# EAGLE design ECU (EAGLE 6.6.0)

## Sheet 1 of 3
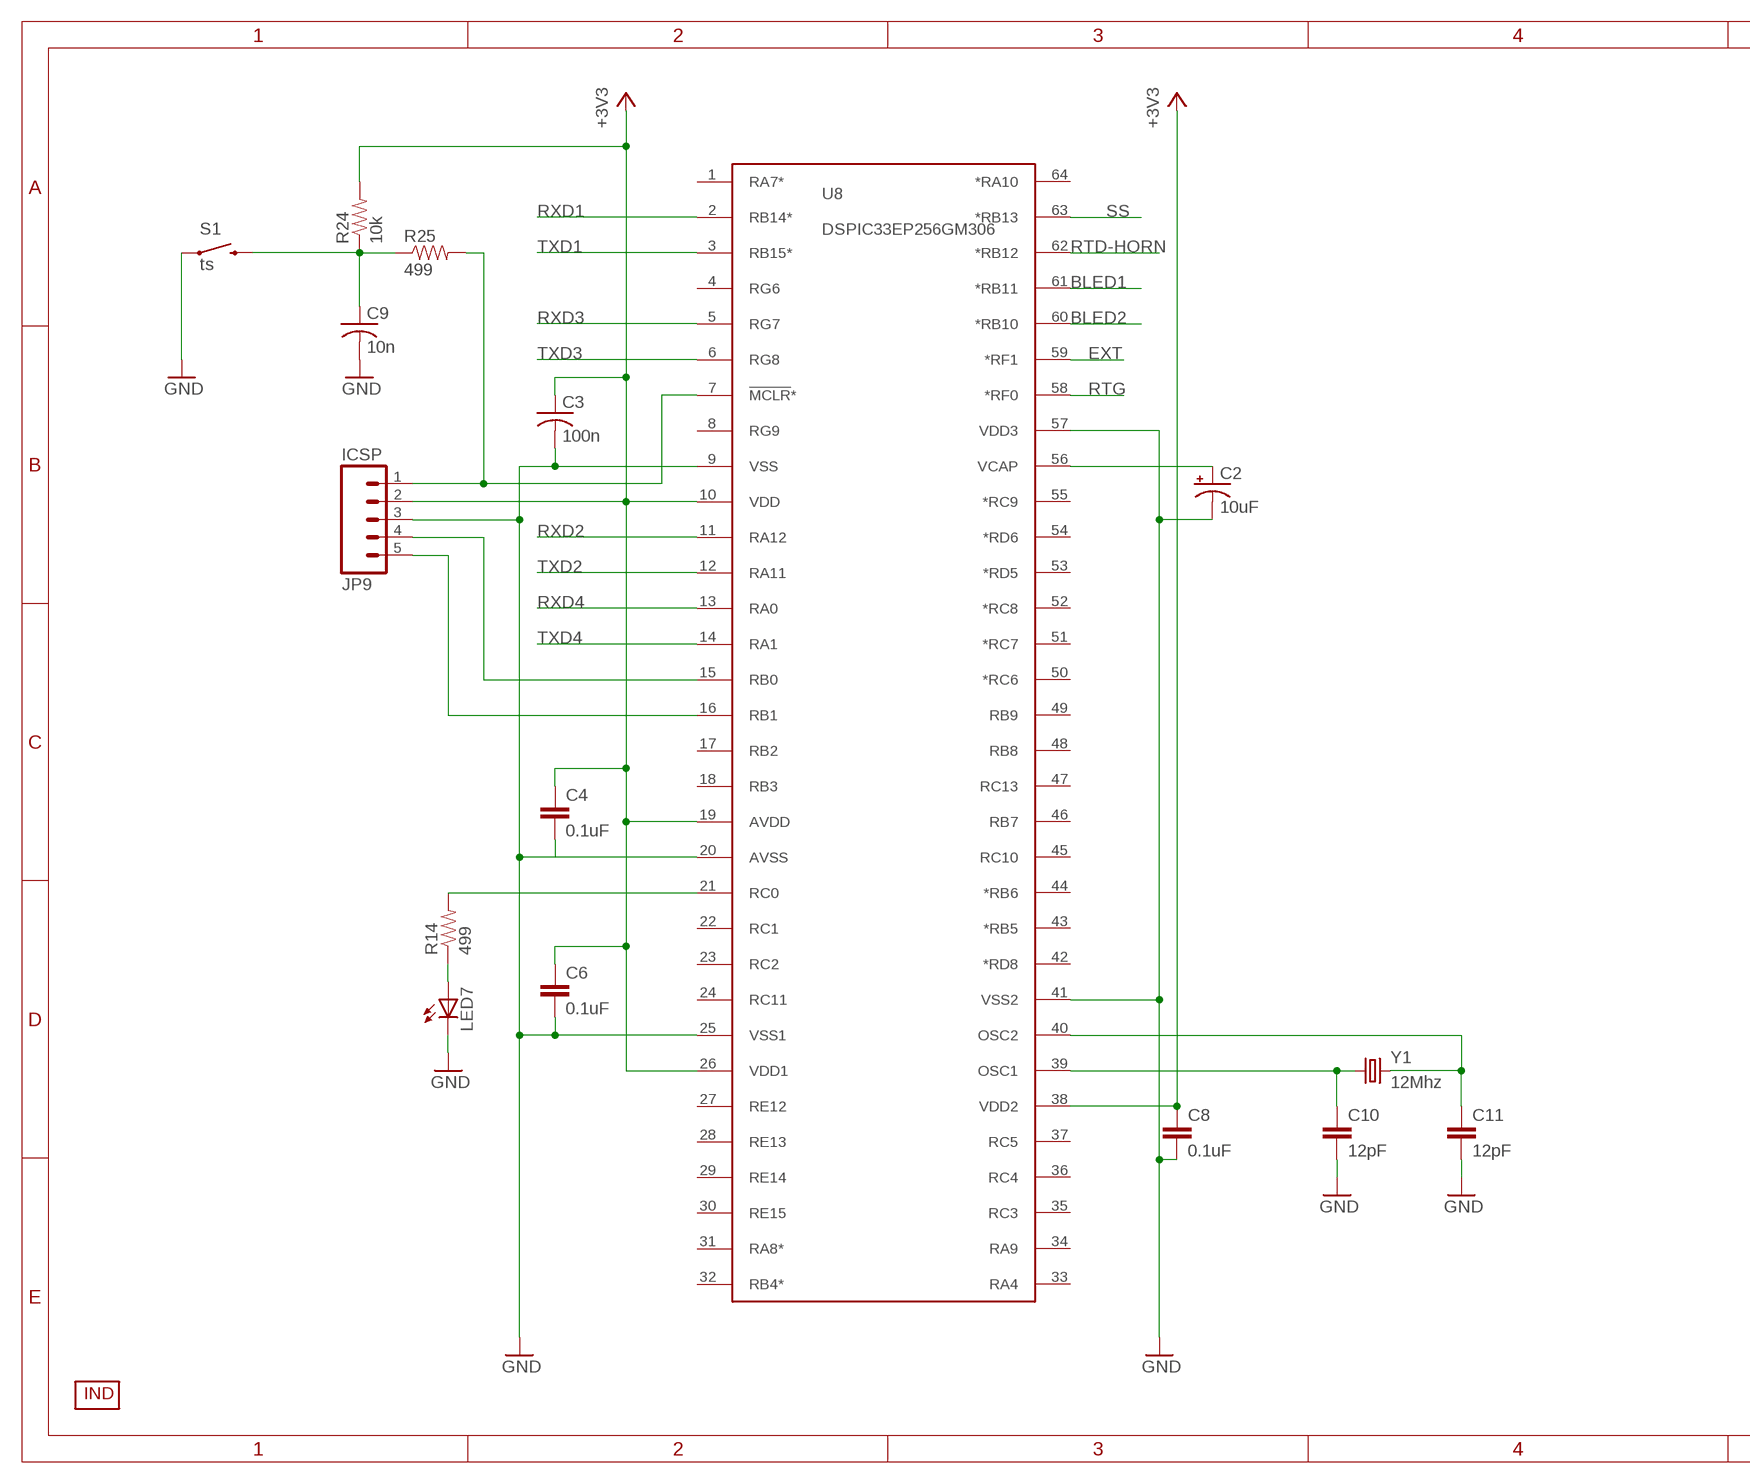
[diagram p0: schematic, sheet 1, part 1 of 2]
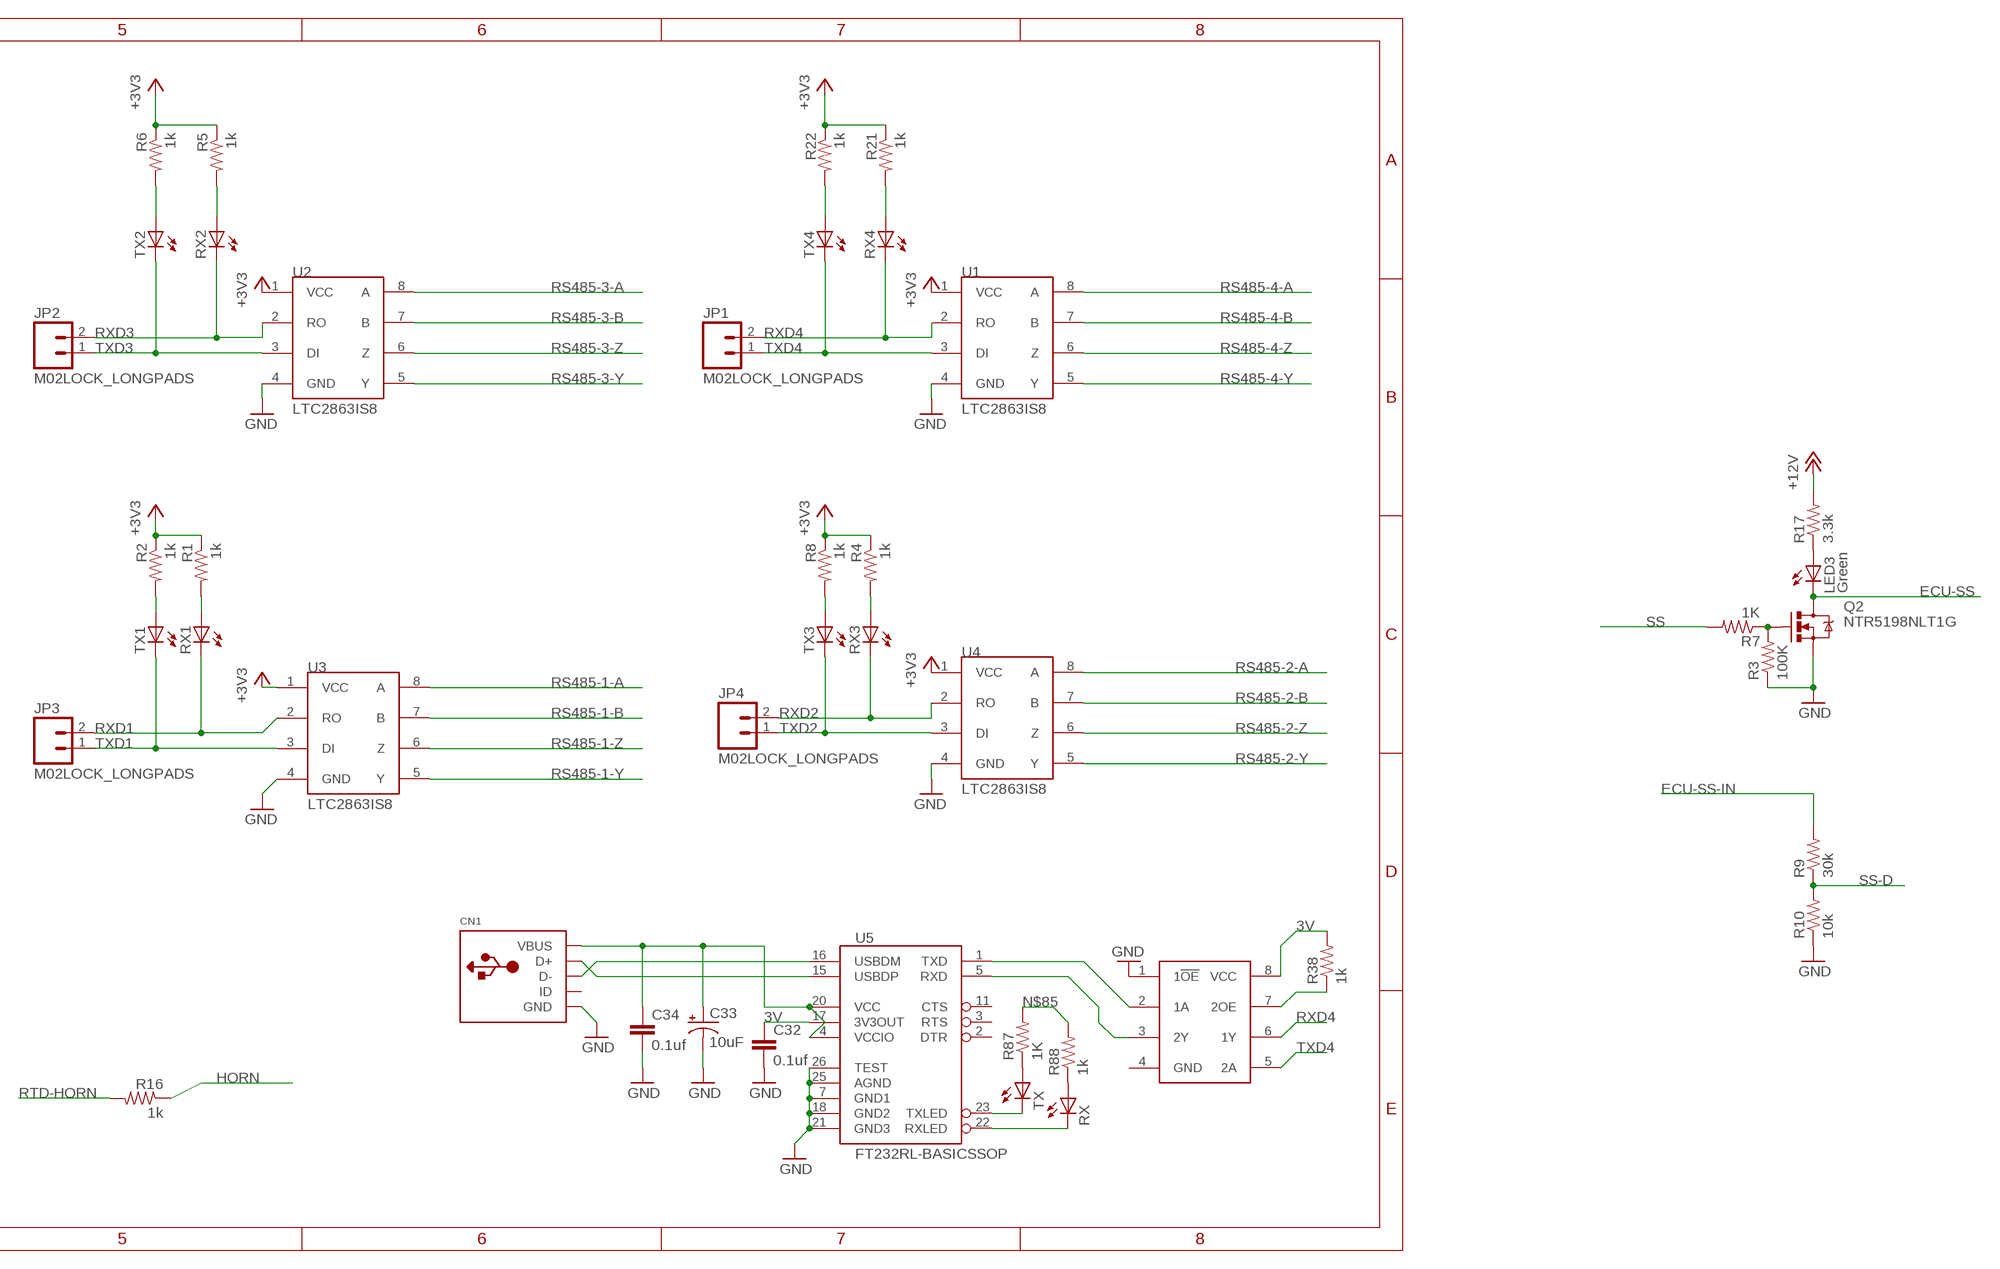
[diagram p1: schematic, sheet 1, part 2 of 2]

### Parts
C2  10uF  10UF-TANT  [EIA3216]
C3  100n  C-USC0805  [C0805]
C4  0.1uF  CAP0805  [0805]
C6  0.1uF  CAP0805  [0805]
C8  0.1uF  CAP0805  [0805]
C9  10n  C-USC0805  [C0805]
C10  12pF  CAP0805  [0805]
C11  12pF  CAP0805  [0805]
C32  0.1uf  CAP0805  [0805]
C33  10uF  CAP_POL1206  [EIA3216]
C34  0.1uf  CAP0805  [0805]
CN1  USBMOLEX  [USB-MINIB-THM-MOLEX]
JP1  M02LOCK_LONGPADS  [1X02_LOCK_LONGPADS]
JP2  M02LOCK_LONGPADS  [1X02_LOCK_LONGPADS]
JP3  M02LOCK_LONGPADS  [1X02_LOCK_LONGPADS]
JP4  M02LOCK_LONGPADS  [1X02_LOCK_LONGPADS]
JP9  ICSP  M05LOCK_LONGPADS  [1X05_LOCK_LONGPADS]
LED3  Green  LEDCHIPLED_0805  [CHIPLED_0805]
LED7  LEDCHIP-LED0805  [CHIP-LED0805]
Q2  NTR5198NLT1G  MOSFET-NCHANNELBSS123LT1G  [SOT23]
R1  1k  RESISTOR0805-RES  [0805]
R2  1k  RESISTOR0805-RES  [0805]
R3  100K  R-US_R0805  [R0805]
R4  1k  RESISTOR0805-RES  [0805]
R5  1k  RESISTOR0805-RES  [0805]
R6  1k  RESISTOR0805-RES  [0805]
R7  1K  R-US_R0805  [R0805]
R8  1k  RESISTOR0805-RES  [0805]
R9  30k  R-US_R0805  [R0805]
R10  10k  R-US_R0805  [R0805]
R14  499  RESISTOR0805-RES  [0805]
R16  1k  RESISTOR0805-RES  [0805]
R17  3.3k  R-US_R0805  [R0805]
R21  1k  RESISTOR0805-RES  [0805]
R22  1k  RESISTOR0805-RES  [0805]
R24  10k  RESISTOR0805-RES  [0805]
R25  499  RESISTOR0805-RES  [0805]
R38  1k  R-US_R0805  [R0805]
R87  1K  R-US_R0805  [R0805]
R88  1k  R-US_R0805  [R0805]
RX  LEDCHIPLED_0805  [CHIPLED_0805]
RX1  LEDCHIP-LED0805  [CHIP-LED0805]
RX2  LEDCHIP-LED0805  [CHIP-LED0805]
RX3  LEDCHIP-LED0805  [CHIP-LED0805]
RX4  LEDCHIP-LED0805  [CHIP-LED0805]
S1  ts  SWITCH-MOMENTARY-2SIDE_EZ  [TACTILE-PTH-SIDEEZ]
TX  LEDCHIPLED_0805  [CHIPLED_0805]
TX1  LEDCHIP-LED0805  [CHIP-LED0805]
TX2  LEDCHIP-LED0805  [CHIP-LED0805]
TX3  LEDCHIP-LED0805  [CHIP-LED0805]
TX4  LEDCHIP-LED0805  [CHIP-LED0805]
U1  LTC2863IS8  ISL83077  [SO08]
U2  LTC2863IS8  ISL83077  [SO08]
U3  LTC2863IS8  ISL83077  [SO08]
U4  LTC2863IS8  ISL83077  [SO08]
U5  FT232RL-BASICSSOP  [SSOP28DB]
U8  DSPIC33EP256GM306  [TQFP-64]
U14  SN74LVC2G241DCTR  [VFSOP-8]
U$1  INDPK1  [PICKIT-PIN-1]
Y1  12Mhz  CRYSTAL5X3  [CRYSTAL-SMD-5X3]

### Nets
3V: C32.1 R38.2 U5.17(3V3OUT) U14.8(VCC)
!RESET: JP9.1 R25.2 U8.7(!MCLR!*)
+3V3: C3.1 C4.1 C6.1 C8.1 JP9.2 R1.1 R2.1 R4.1 R5.1 R6.1 R8.1 R21.1 R22.1 R24.2 U1.1(VCC) U2.1(VCC) U3.1(VCC) U4.1(VCC) U8.10(VDD) U8.19(AVDD) U8.26(VDD1) U8.38(VDD2) ; also sheet 2
+12V: R17.2 ; also sheet 3
BLED1: U8.61(*RB11)
BLED2: U8.60(*RB10)
ECU-SS: LED3.C Q2.3(D) ; also sheet 3
ECU-SS-IN: R9.2 ; also sheet 3
EXT: U8.59(*RF1)
GND: C2.C(-) C3.2 C4.2 C6.2 C8.2 C9.2 C10.2 C11.2 C32.2 C33.C(-) C34.2 CN1.GND JP9.3 LED7.C Q2.2(S) R3.1 R10.1 S1.1 U1.4(GND) U2.4(GND) U3.4(GND) U4.4(GND) U5.7(GND1) U5.18(GND2) U5.21(GND3) U5.25(AGND) U5.26(TEST) U8.9(VSS) U8.20(AVSS) U8.25(VSS1) U8.41(VSS2) U8.57(VDD3) U14.1(1!OE) ; also sheet 2,3
HORN: R16.1 ; also sheet 3
N$2: Q2.1(G) R3.2 R7.1
N$4: R38.1 U14.7(2OE)
N$7: R1.2 RX1.A
N$8: R2.2 TX1.A
N$12: R4.2 RX3.A
N$13: R8.2 TX3.A
N$17: R5.2 RX2.A
N$18: R6.2 TX2.A
N$20: LED7.A R14.1
N$24: R21.2 RX4.A
N$26: C2.A(+) U8.56(VCAP)
N$34: C11.1 U8.40(OSC2) Y1.3
N$36: C10.1 U8.39(OSC1) Y1.1
N$38: C9.1 R24.1 R25.1 S1.2
N$39: JP9.4 U8.15(RB0)
N$40: JP9.5 U8.16(RB1)
N$41: R14.2 U8.21(RC0)
N$44: R22.2 TX4.A
N$49: LED3.A R17.1
N$78: CN1.D- U5.16(USBDM)
N$79: CN1.D+ U5.15(USBDP)
N$81: R87.1 TX.A
N$82: R88.1 RX.A
N$83: TX.C U5.23(TXLED)
N$84: RX.C U5.22(RXLED)
N$85: C33.A(+) C34.1 CN1.VBUS R87.2 R88.2 U5.4(VCCIO) U5.20(VCC)
N$93: U5.1(TXD) U14.2(1A)
N$94: U5.5(RXD) U14.3(2Y)
RS485-1-A: U3.8(A) ; also sheet 3
RS485-1-B: U3.7(B) ; also sheet 3
RS485-1-Y: U3.5(Y) ; also sheet 3
RS485-1-Z: U3.6(Z) ; also sheet 3
RS485-2-A: U4.8(A) ; also sheet 3
RS485-2-B: U4.7(B) ; also sheet 3
RS485-2-Y: U4.5(Y) ; also sheet 3
RS485-2-Z: U4.6(Z) ; also sheet 3
RS485-3-A: U2.8(A) ; also sheet 3
RS485-3-B: U2.7(B) ; also sheet 3
RS485-3-Y: U2.5(Y) ; also sheet 3
RS485-3-Z: U2.6(Z) ; also sheet 3
RS485-4-A: U1.8(A) ; also sheet 3
RS485-4-B: U1.7(B) ; also sheet 3
RS485-4-Y: U1.5(Y) ; also sheet 3
RS485-4-Z: U1.6(Z) ; also sheet 3
RTD-HORN: R16.2 U8.62(*RB12)
RTG: U8.58(*RF0)
RXD1: JP3.2 RX1.C U3.2(RO) U8.2(RB14*)
RXD2: JP4.2 RX3.C U4.2(RO) U8.11(RA12)
RXD3: JP2.2 RX2.C U2.2(RO) U8.5(RG7)
RXD4: JP1.2 RX4.C U1.2(RO) U8.13(RA0) U14.6(1Y)
SS: R7.2 U8.63(*RB13)
SS-D: R9.1 R10.2
TXD1: JP3.1 TX1.C U3.3(DI) U8.3(RB15*)
TXD2: JP4.1 TX3.C U4.3(DI) U8.12(RA11)
TXD3: JP2.1 TX2.C U2.3(DI) U8.6(RG8)
TXD4: JP1.1 TX4.C U1.3(DI) U8.14(RA1) U14.5(2A)
Unconnected: CN1.ID U5.2(DTR) U5.3(RTS) U5.11(CTS) U8.1(RA7*) U8.4(RG6) U8.8(RG9) U8.17(RB2) U8.18(RB3) U8.22(RC1) U8.23(RC2) U8.24(RC11) U8.27(RE12) U8.28(RE13) U8.29(RE14) U8.30(RE15) U8.31(RA8*) U8.32(RB4*) U8.33(RA4) U8.34(RA9) U8.35(RC3) U8.36(RC4) U8.37(RC5) U8.42(*RD8) U8.43(*RB5) U8.44(*RB6) U8.45(RC10) U8.46(RB7) U8.47(RC13) U8.48(RB8) U8.49(RB9) U8.50(*RC6) U8.51(*RC7) U8.52(*RC8) U8.53(*RD5) U8.54(*RD6) U8.55(*RC9) U8.64(*RA10) U14.4(GND)

## Sheet 2 of 3
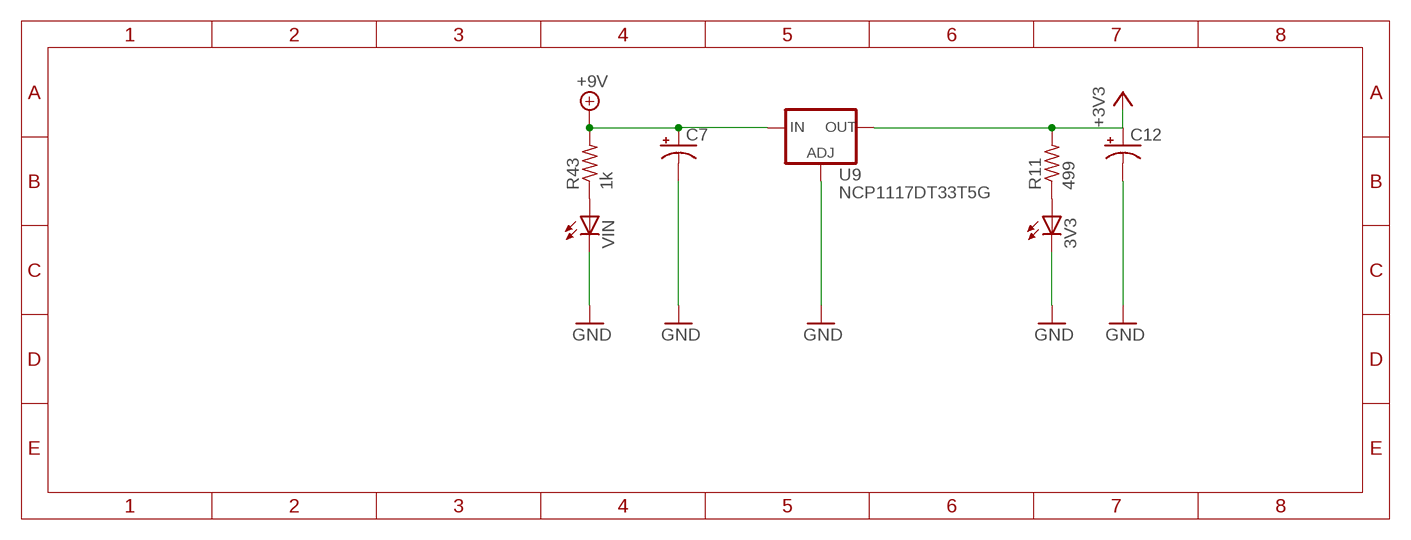
[diagram p2: schematic, sheet 2]

### Parts
3V3  LEDCHIP-LED0805  [CHIP-LED0805]
C7  CAP_POL7343  [EIA7343]
C12  CAP_POL3528  [EIA3528]
R11  499  R-US_R0805  [R0805]
R43  1k  R-US_R0805  [R0805]
U9  NCP1117DT33T5G  V_REG_317DPACK  [V-REG_DPACK]
VIN  LEDCHIP-LED0805  [CHIP-LED0805]

### Nets
+3V3: C12.A(+) R11.2 U9.4(OUT) ; also sheet 1
+9V: C7.A(+) R43.2 U9.3(IN) ; also sheet 3
GND: 3V3.C C7.C(-) C12.C(-) U9.1(ADJ) VIN.C ; also sheet 1,3
N$3: 3V3.A R11.1
N$33: R43.1 VIN.A

## Sheet 3 of 3
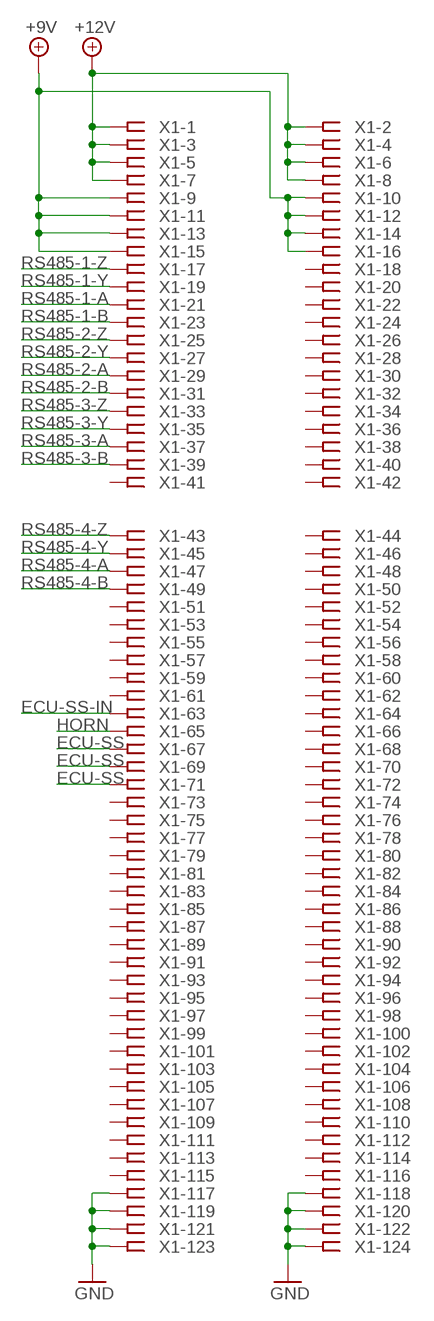
[diagram p3: schematic, sheet 3]

### Parts
X1  AGP-3X3  [AGP-3X3]

### Nets
+9V: X1.9 X1.10 X1.11 X1.12 X1.13 X1.14 X1.15 X1.16 ; also sheet 2
+12V: X1.1 X1.2 X1.3 X1.4 X1.5 X1.6 X1.7 X1.8 ; also sheet 1
ECU-SS: X1.67 X1.69 X1.71 ; also sheet 1
ECU-SS-IN: X1.63 ; also sheet 1
GND: X1.117 X1.118 X1.119 X1.120 X1.121 X1.122 X1.123 X1.124 ; also sheet 1,2
RS485-1-A: X1.21 ; also sheet 1
RS485-1-B: X1.23 ; also sheet 1
RS485-1-Y: X1.19 ; also sheet 1
RS485-1-Z: X1.17 ; also sheet 1
RS485-2-A: X1.29 ; also sheet 1
RS485-2-B: X1.31 ; also sheet 1
RS485-2-Y: X1.27 ; also sheet 1
RS485-2-Z: X1.25 ; also sheet 1
RS485-3-A: X1.37 ; also sheet 1
RS485-3-B: X1.39 ; also sheet 1
RS485-3-Y: X1.35 ; also sheet 1
RS485-3-Z: X1.33 ; also sheet 1
RS485-4-A: X1.47 ; also sheet 1
RS485-4-B: X1.49 ; also sheet 1
RS485-4-Y: X1.45 ; also sheet 1
RS485-4-Z: X1.43 ; also sheet 1
Unconnected: X1.18 X1.20 X1.22 X1.24 X1.26 X1.28 X1.30 X1.32 X1.34 X1.36 X1.38 X1.40 X1.41 X1.42 X1.44 X1.46 X1.48 X1.50 X1.51 X1.52 X1.53 X1.54 X1.55 X1.56 X1.57 X1.58 X1.59 X1.60 X1.61 X1.62 X1.64 X1.65 X1.66 X1.68 X1.70 X1.72 X1.73 X1.74 X1.75 X1.76 X1.77 X1.78 X1.79 X1.80 X1.81 X1.82 X1.83 X1.84 X1.85 X1.86 X1.87 X1.88 X1.89 X1.90 X1.91 X1.92 X1.93 X1.94 X1.95 X1.96 X1.97 X1.98 X1.99 X1.100 X1.101 X1.102 X1.103 X1.104 X1.105 X1.106 X1.107 X1.108 X1.109 X1.110 X1.111 X1.112 X1.113 X1.114 X1.115 X1.116

## Library data of the parts
3V3 LED3 LED7 RX RX1-RX4 TX TX1-TX4 VIN = adafruit:LED: LED OSRAM: - CHIPLED LG R971, LG N971, LY N971, LG Q971, LY Q971, LO R971, LY R971 LH N974, LH R974 LS Q976, LO Q976, LY Q976 LO Q996 - Hyper CHIPLED LW Q18S LB Q993, LB Q99A, LB R99A - SideLED LS A670, LO A670, LY A670, LG A670, LP A670 LB A673, LV A673, LT A673, LW A673 LH A674 LY A675 LS A676, LA A676, LO A676, LY A676, LW A676 LS A679, LY A679, LG A679 - Hyper Micro SIDELED® LS Y876, LA Y876, LO Y876, LY Y876 LT Y87S - SmartLED LW L88C, LW L88S LB L89C, LB L89S, LG L890 LS L89K, LO L89K, LY L89K LS L896, LA L896, LO L896, LY L896 - TOPLED LS T670, LO T670, LY T670, LG T670, LP T670 LSG T670, LSP T670, LSY T670, LOP T670, LYG T670 LG T671, LOG T671, LSG T671 LB T673, LV T673, LT T673, LW T673 LH T674 LS T676, LA T676, LO T676, LY T676, LB T676, LH T676, LSB T676, LW T676 LB T67C, LV T67C, LT T67C, LS T67K, LO T67K, LY T67K, LW E67C LS E67B, LA E67B, LO E67B, LY E67B, LB E67C, LV E67C, LT E67C LW T67C LS T679, LY T679, LG T679 LS T770, LO T770, LY T770, LG T770, LP T770 LB T773, LV T773, LT T773, LW T773 LH T774 LS E675, LA E675, LY E675, LS T675 LS T776, LA T776, LO T776, LY T776, LB T776 LHGB T686 LT T68C, LB T68C - Hyper Mini TOPLED® LB M676 - Mini TOPLED Santana® LG M470 LS M47K, LO M47K, LY M47K Source: http://www.osram.convergy.de/
C2 = SparkFun-Capacitors:10UF-TANT: 10uF Tantalum SMT CAP-00811- 16V 10% (EIA-3216); PROD_ID: CAP-00811
C3 C9 = adafruit:C-US: CAPACITOR, American symbol
C4 C6 C8 C10 C11 = SparkFun-Capacitors:CAP: Capacitor Standard 0603 ceramic capacitor, and 0.1" leaded capacitor.
C7 C12 = SparkFun-Capacitors:CAP_POL: Capacitor Polarized These are standard SMD and PTH capacitors. Normally 10uF, 47uF, and 100uF in electrolytic and tantalum varieties. Always verify the external diameter of the through hole cap, it varies with capacity, voltage, and manufacturer. The EIA devices should be standard.
C32 C34 = SparkFun:CAP: Capacitor Standard 0603 ceramic capacitor, and 0.1" leaded capacitor.
C33 = SparkFun:CAP_POL: Capacitor Polarized These are standard SMD and PTH capacitors. Normally 10uF, 47uF, and 100uF in electrolytic and tantalum varieties. Always verify the external diameter of the through hole cap, it varies with capacity, voltage, and manufacturer. The EIA devices should be standard.
CN1 = adafruit:USB: USB Connectors USBMINIB - Surface Mount Female Mini-B USB Connector 4UConnector: 06564 By microbuilder.eu Thru-hole RA Female Mini-B USB Connector 4UConnector: 18732 By ladyada.net
JP1-JP4 = SparkFun-Connectors:M02: Standard 2-pin 0.1" header. Use with - straight break away headers ( PRT-00116) - right angle break away headers (PRT-00553) - swiss pins (PRT-00743) - machine pins (PRT-00117) - female headers (PRT-00115) Molex polarized connector foot print use with: PRT-08233 with associated crimp pins and housings. 2.54_SCREWTERM for use with PRT-10571. 3.5mm Screw Terminal footprints for PRT-08084 5mm Screw Terminal footprints for use with PRT-08433
JP9 = SparkFun-Connectors:M05: Header 5 Standard 5-pin 0.1" header. Use with straight break away headers (SKU : PRT-00116), right angle break away headers (PRT-00553), swiss pins (PRT-00743), machine pins (PRT-00117), and female headers (PRT-00115). Molex polarized connector foot print use with SKU : PRT-08230 with associated crimp pins and housings.
Q2 = SparkFun-DiscreteSemi:MOSFET-NCHANNEL: Common NMOSFET Parts MFG P/N Store ID Prod ID FDD8780 TRANS-09984 SI7820DN TRANS-11055 FDS6630A IC-08089 2N7002PW TRANS-11151 FQP30N06L COM-10213 TRANS-10060 BSS123LT1G TRANS-08345 BSS138 TRANS-00830 BS170 2N7000; PROD_ID: TRANS-08345
R1 R2 R4-R6 R8 R14 R16 R21 R22 R24 = SparkFun-Passives:RESISTOR: Resistor Basic schematic elements and footprints for 0603, 1206, and PTH resistors.
R3 R7 R9-R11 R17 R38 R43 R87 R88 = adafruit:R-US_: RESISTOR, American symbol
R25 = SparkFun-Resistors:RESISTOR: Resistor Basic schematic elements and footprints for 0603, 1206, and PTH resistors.
S1 = SparkFun-Electromechanical:SWITCH-MOMENTARY-2: Various NO switches- pushbuttons, reed, etc
U1-U4 = NASA_LIB:ISL83077
U5 = SparkFun:FT232RL-BASIC: USB UART This is the simplified version of the FT232RL unit. Only what you need, nothing you don't. Spark Fun Electronics SKU : COM-00650
U8 = FSAE Eletric:DSPIC33EP256GM306
U9 = SparkFun-PowerIC:V_REG_317: Voltage Regulator Standard LM317 adjustable voltage regulator. AOI (Adjust Output Input). Google 'LM317 Calculator' for easy to use app to get the two resistor values needed. 240/720 for 5V output. 240/390 for 3.3V output. Spark Fun Electronics SKU : COM-00527
U14 = Cleaverbrooks:SN74LVC2G241DCTR
U$1 = FSAE Eletric:IND
X1 = con-pc:AGP-3X3
Y1 = SparkFun-FreqCtrl:CRYSTAL: Various standard crystals. Proven footprints. Spark Fun Electronics SKU : COM-00534

## Board
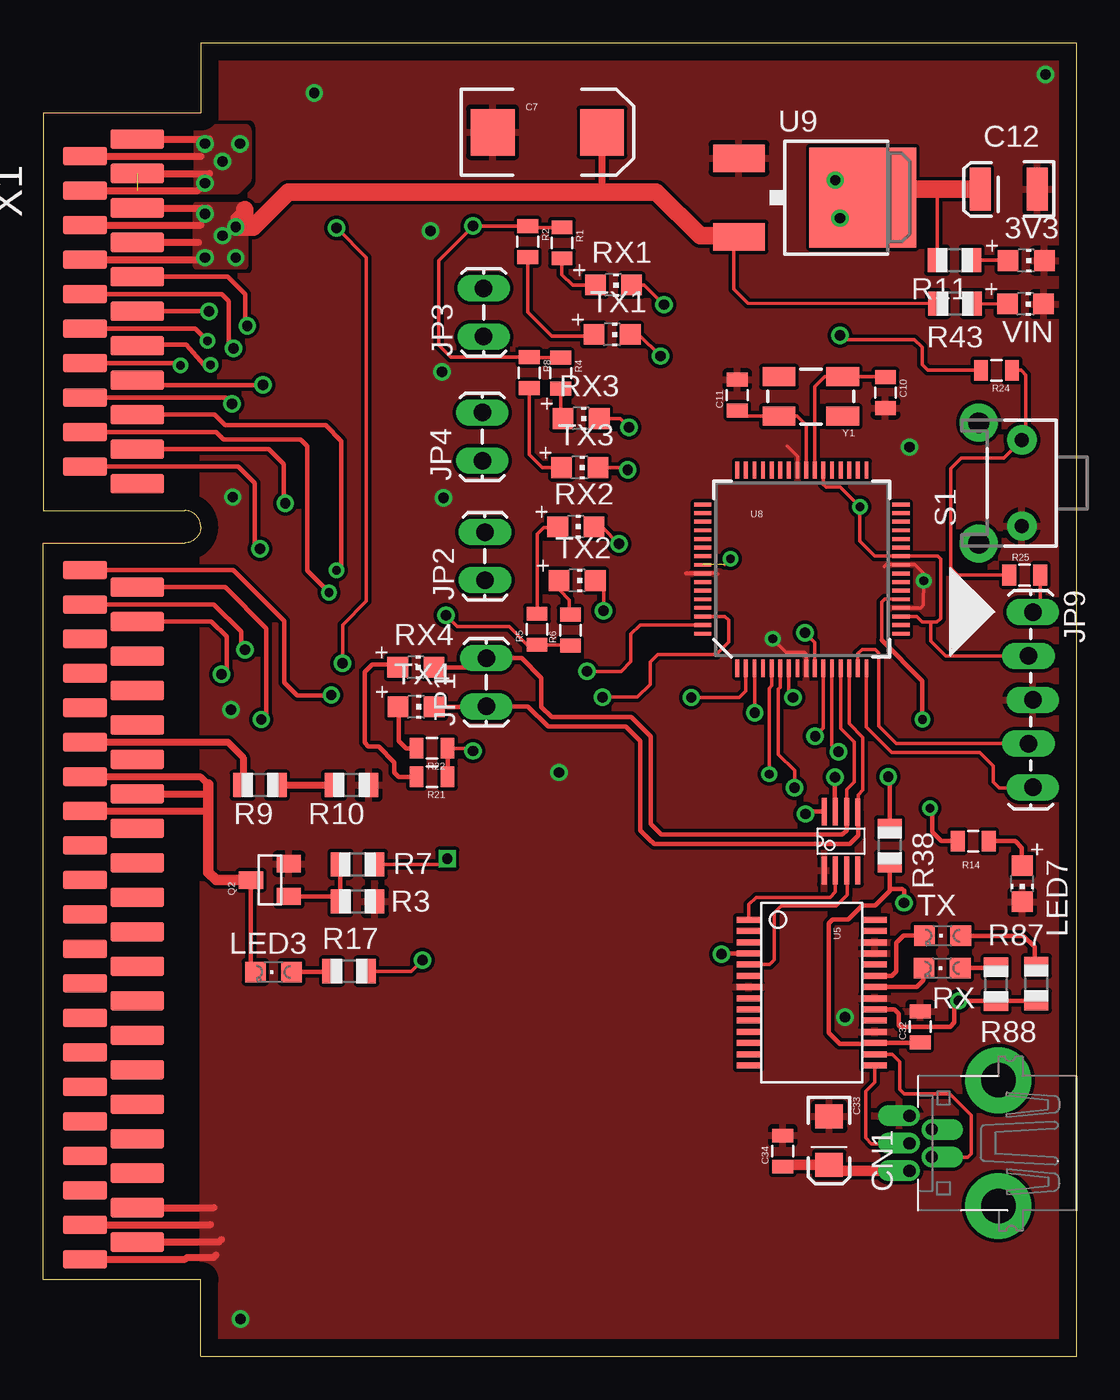
[diagram p4: board, top side]
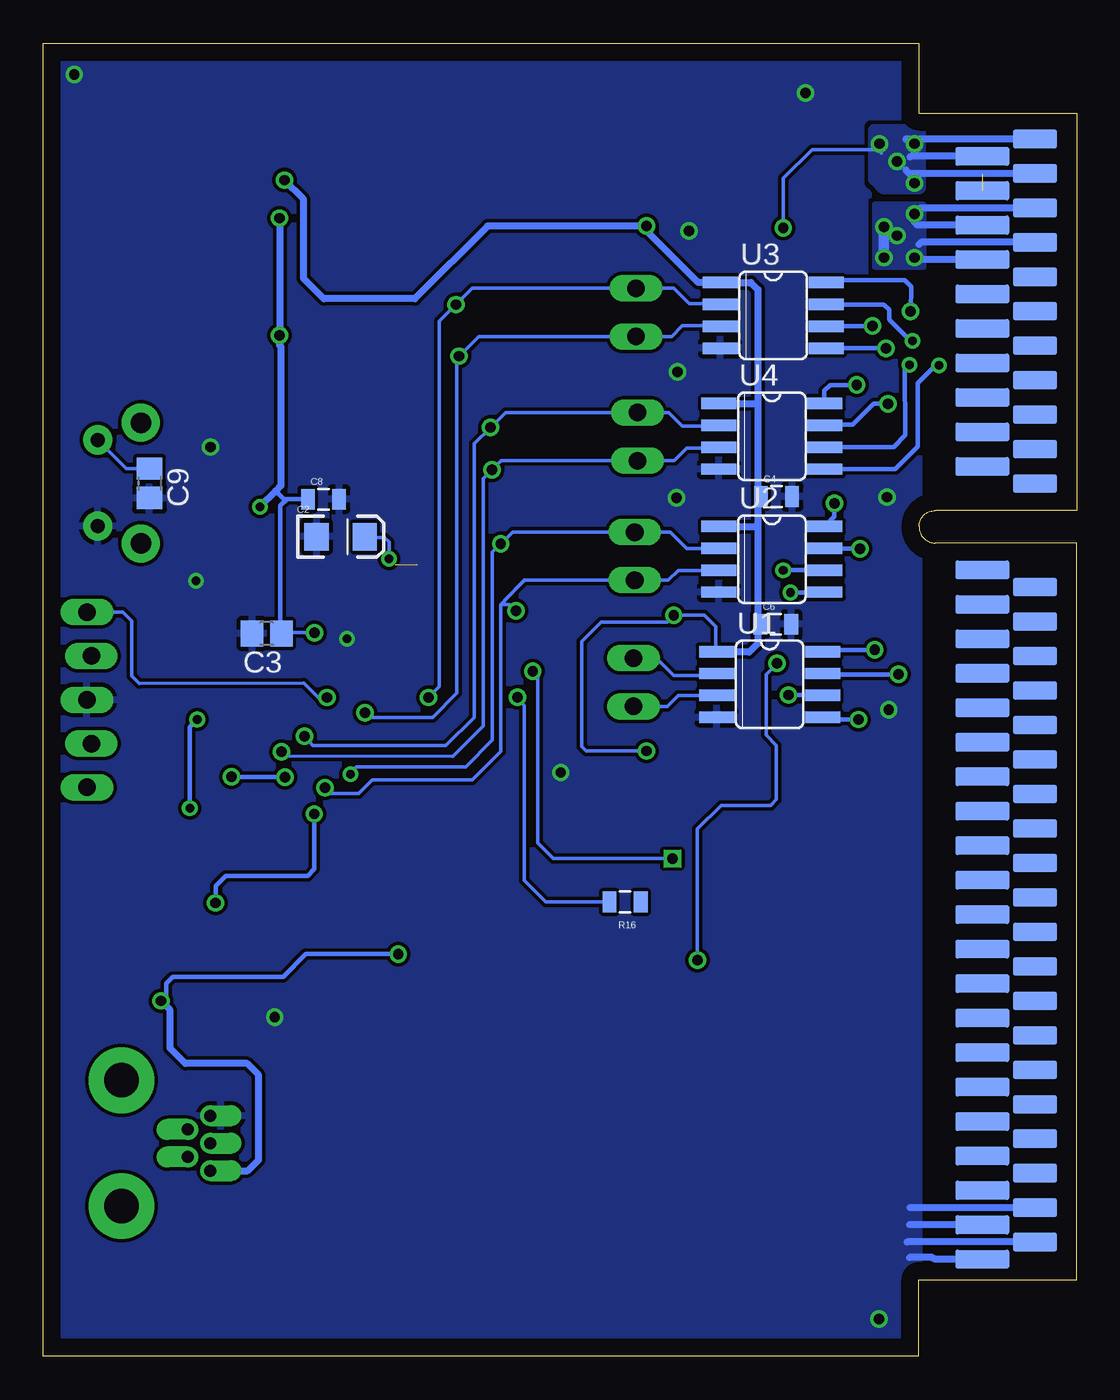
[diagram p5: board, bottom side, seen from below]

Size 59.94 x 76.2 mm. Coordinates in mm from the lower left corner, seen from the top.
Copper layers (1*16): Top 0.035mm / dielectric 1.5mm / Bottom 0.035mm
Design rules "default": minimum track width 10mil, minimum drill 24mil, track to track 8mil, track to pad 8mil, pad to pad 8mil, via to via 8mil, smd to smd 8mil, copper to edge 40mil, drill to drill 8mil, minimum pad ring 10mil, minimum via ring 8mil, stop-mask expansion 4mil, vias tented up to drill 0mil, thermal gap 10mil

### Footprints (pad centres in the part's own frame; a part is rotated, then mirrored left to right if it is on the bottom)
CHIP-LED0805 = smd 1.2 x 1.2: A 0,-1.05; C 0,1.05
EIA3216 = smd 1.4 x 1.6: A 1.4,0; C -1.4,0
C0805 = smd 1.3 x 1.5: 1 -0.85,0; 2 0.85,0
0805 = smd 0.8 x 1.2: 1 -0.9,0; 2 0.9,0
EIA7343 = smd 2.55 x 2.7: A 3.17,0; C -3.17,0
EIA3528 = smd 1.2 x 2.5: A 1.65,0; C -1.65,0
USB-MINIB-THM-MOLEX = drill 0.7 offset: D+ 0,9.72; D- -0.8,8.42; GND 1.6,9.72; ID 0.8,8.42; VBUS -1.6,9.72 | drill 2 pad 3.81: GND1 -3.65,4.57; GND4 3.65,4.57
1X02_LOCK_LONGPADS = drill 1.016 long: 1 -0.127,0; 2 2.667,0
1X05_LOCK_LONGPADS = drill 1.016 long: 1 0,0; 2 2.54,-0.254; 3 5.08,0; 4 7.62,-0.254; 5 10.16,0
CHIPLED_0805 = smd 1.2 x 1.2: A 0,-1.05; C 0,1.05
SOT23 = smd 1 x 1.4: 1 -0.95,-1.1; 2 0.95,-1.1; 3 0,1.1
R0805 = smd 1.1 x 1.4: 1 -1,0; 2 1,0
TACTILE-PTH-SIDEEZ = drill 0.8 pad 1.7: 1 -2.5,0; 2 2.5,0 | drill 1.2 pad 2.2: ANCHOR1 -3.5,2.5; ANCHOR2 3.5,2.5
SO08 = smd 0.66 x 2.032: 1 -1.905,-3.073; 2 -0.635,-3.073; 3 0.635,-3.073; 4 1.905,-3.073; 5 1.905,3.073; 6 0.635,3.073; 7 -0.635,3.073; 8 -1.905,3.073
SSOP28DB = smd 0.348 x 1.397: 1 -4.225,-3.656; 2 -3.575,-3.656; 3 -2.925,-3.656; 4 -2.275,-3.656; 5 -1.625,-3.656; 6 -0.975,-3.656; 7 -0.325,-3.656; 8 0.325,-3.656; 9 0.975,-3.656; 10 1.625,-3.656; 11 2.275,-3.656; 12 2.925,-3.656; 13 3.575,-3.656; 14 4.225,-3.656; 15 4.225,3.656; 16 3.575,3.656; 17 2.925,3.656; 18 2.275,3.656; 19 1.625,3.656; 20 0.975,3.656; 21 0.325,3.656; 22 -0.325,3.656; 23 -0.975,3.656; 24 -1.625,3.656; 25 -2.275,3.656; 26 -2.925,3.656; 27 -3.575,3.656; 28 -4.225,3.656
TQFP-64 = smd 0.22 x 1: 1 -3.75,-5.75; 2 -3.25,-5.75; 3 -2.75,-5.75; 4 -2.25,-5.75; 5 -1.75,-5.75; 6 -1.25,-5.75; 7 -0.75,-5.75; 8 -0.25,-5.75; 9 0.25,-5.75; 10 0.75,-5.75; 11 1.25,-5.75; 12 1.75,-5.75; 13 2.25,-5.75; 14 2.75,-5.75; 15 3.25,-5.75; 16 3.75,-5.75; 33 3.75,5.75; 34 3.25,5.75; 35 2.75,5.75; 36 2.25,5.75; 37 1.75,5.75; 38 1.25,5.75; 39 0.75,5.75; 40 0.25,5.75; 41 -0.25,5.75; 42 -0.75,5.75; 43 -1.25,5.75; 44 -1.75,5.75; 45 -2.25,5.75; 46 -2.75,5.75; 47 -3.25,5.75; 48 -3.75,5.75 | smd 1 x 0.22: 17 5.75,-3.75; 18 5.75,-3.25; 19 5.75,-2.75; 20 5.75,-2.25; 21 5.75,-1.75; 22 5.75,-1.25; 23 5.75,-0.75; 24 5.75,-0.25; 25 5.75,0.25; 26 5.75,0.75; 27 5.75,1.25; 28 5.75,1.75; 29 5.75,2.25; 30 5.75,2.75; 31 5.75,3.25; 32 5.75,3.75; 49 -5.75,3.75; 50 -5.75,3.25; 51 -5.75,2.75; 52 -5.75,2.25; 53 -5.75,1.75; 54 -5.75,1.25; 55 -5.75,0.75; 56 -5.75,0.25; 57 -5.75,-0.25; 58 -5.75,-0.75; 59 -5.75,-1.25; 60 -5.75,-1.75; 61 -5.75,-2.25; 62 -5.75,-2.75; 63 -5.75,-3.25; 64 -5.75,-3.75
V-REG_DPACK = smd 1.6 x 3: 1 -2.28,-4.8; 3 2.28,-4.8 | smd 5.8 x 6.2: 4 0,2.38
VFSOP-8 = smd 0.3 x 1.6: 1 -0.98,-1.7; 2 -0.33,-1.7; 3 0.33,-1.7; 4 0.98,-1.7; 5 0.97,1.69; 6 0.325,1.7; 7 -0.33,1.7; 8 -0.98,1.71
AGP-3X3 = smd 3.09 x 1.09: 1 -3.684,70.636; 5 -3.684,68.636; 9 -3.684,66.636; 13 -3.684,64.636; 17 -3.684,62.636; 21 -3.684,60.636; 25 -3.684,58.636; 29 -3.684,56.636; 33 -3.684,54.636; 37 -3.684,52.636; 41 -3.684,50.636; 45 -3.684,44.636; 49 -3.684,42.636; 53 -3.684,40.636; 57 -3.684,38.636; 61 -3.684,36.636; 65 -3.684,34.636; 69 -3.684,32.636; 73 -3.684,30.636; 77 -3.684,28.636; 81 -3.684,26.636; 85 -3.684,24.636; 89 -3.684,22.636; 93 -3.684,20.636; 97 -3.684,18.636; 101 -3.684,16.636; 105 -3.684,14.636; 109 -3.684,12.636; 113 -3.684,10.636; 117 -3.684,8.636; 121 -3.684,6.636 | smd 2.56 x 1.09 bottom: 2 -6.724,70.636; 6 -6.724,68.636; 10 -6.724,66.636; 14 -6.724,64.636; 18 -6.724,62.636; 22 -6.724,60.636; 26 -6.724,58.636; 30 -6.724,56.636; 34 -6.724,54.636; 38 -6.724,52.636; 42 -6.724,50.636; 46 -6.724,44.636; 50 -6.724,42.636; 54 -6.724,40.636; 58 -6.724,38.636; 62 -6.724,36.636; 66 -6.724,34.636; 70 -6.724,32.636; 74 -6.724,30.636; 78 -6.724,28.636; 82 -6.724,26.636; 86 -6.724,24.636; 90 -6.724,22.636; 94 -6.724,20.636; 98 -6.724,18.636; 102 -6.724,16.636; 106 -6.724,14.636; 110 -6.724,12.636; 114 -6.724,10.636; 118 -6.724,8.636; 122 -6.724,6.636 | smd 2.56 x 1.09: 3 -6.724,69.636; 7 -6.724,67.636; 11 -6.724,65.636; 15 -6.724,63.636; 19 -6.724,61.636; 23 -6.724,59.636; 27 -6.724,57.636; 31 -6.724,55.636; 35 -6.724,53.636; 39 -6.724,51.636; 43 -6.724,45.636; 47 -6.724,43.636; 51 -6.724,41.636; 55 -6.724,39.636; 59 -6.724,37.636; 63 -6.724,35.636; 67 -6.724,33.636; 71 -6.724,31.636; 75 -6.724,29.636; 79 -6.724,27.636; 83 -6.724,25.636; 87 -6.724,23.636; 91 -6.724,21.636; 95 -6.724,19.636; 99 -6.724,17.636; 103 -6.724,15.636; 107 -6.724,13.636; 111 -6.724,11.636; 115 -6.724,9.636; 119 -6.724,7.636; 123 -6.724,5.636 | smd 3.09 x 1.09 bottom: 4 -3.684,69.636; 8 -3.684,67.636; 12 -3.684,65.636; 16 -3.684,63.636; 20 -3.684,61.636; 24 -3.684,59.636; 28 -3.684,57.636; 32 -3.684,55.636; 36 -3.684,53.636; 40 -3.684,51.636; 44 -3.684,45.636; 48 -3.684,43.636; 52 -3.684,41.636; 56 -3.684,39.636; 60 -3.684,37.636; 64 -3.684,35.636; 68 -3.684,33.636; 72 -3.684,31.636; 76 -3.684,29.636; 80 -3.684,27.636; 84 -3.684,25.636; 88 -3.684,23.636; 92 -3.684,21.636; 96 -3.684,19.636; 100 -3.684,17.636; 104 -3.684,15.636; 108 -3.684,13.636; 112 -3.684,11.636; 116 -3.684,9.636; 120 -3.684,7.636; 124 -3.684,5.636
CRYSTAL-SMD-5X3 = smd 1.9 x 1.1: 1 -1.85,-1.15; 2 1.85,-1.15; 3 1.85,1.15; 4 -1.85,1.15

### Placement (x,y rotation side)
3V3  57.02,63.58 270 top
C2  42.68,47.57 0 bottom
C3  46.98,41.94 180 bottom
C4  17.4,49.89 0 bottom
C6  17.45,42.48 0 bottom
C7  29.24,71.03 0 top
C8  43.68,49.74 0 bottom
C9  53.78,50.66 270 bottom
C10  48.85,55.92 270 top
C11  40.26,55.78 90 top
C12  56.01,67.72 180 top
C32  50.88,19.13 90 top
C33  45.59,12.52 270 top
C34  42.9,11.91 90 top
CN1  59.97,12.37 90 top
JP1  25.7,37.85 90 top
JP2  25.63,45.16 90 top
JP3  25.55,59.31 90 top
JP4  25.48,52.1 90 top
JP9  57.4,43.18 270 top
LED3  13.36,22.3 90 top
LED7  56.79,27.43 180 top
Q2  13.16,27.64 90 top
R1  30.09,64.6 270 top
R2  28.11,64.68 270 top
R3  18.24,26.39 180 top
R4  30.02,57.05 270 top
R5  28.65,42.19 90 top
R6  30.58,42.14 90 top
R7  18.24,28.55 0 top
R8  28.19,57.07 270 top
R9  12.57,33.15 180 top
R10  17.88,33.15 180 top
R11  52.86,63.6 180 top
R14  53.95,29.9 180 top
R16  26.19,26.37 180 bottom
R17  17.75,22.35 0 top
R21  22.56,33.63 180 top
R22  22.56,35.28 180 top
R24  55.3,57.21 180 top
R25  56.93,45.34 0 top
R38  49.1,29.64 270 top
R43  52.89,61.09 180 top
R87  57.61,21.64 270 top
R88  55.27,21.59 270 top
RX  52.15,22.53 90 top
RX1  33.08,62.16 270 top
RX2  30.9,48.14 270 top
RX3  31.2,54.41 270 top
RX4  21.62,39.98 270 top
S1  56.77,50.67 90 top
TX  52.17,24.41 90 top
TX1  33.01,59.29 270 top
TX2  30.97,45.02 270 top
TX3  31.13,51.57 270 top
TX4  21.64,37.69 270 top
U1  17.81,38.99 270 bottom
U2  17.68,46.25 270 bottom
U3  17.6,60.4 270 bottom
U4  17.68,53.39 270 bottom
U5  44.58,21.11 270 top
U8  44.01,45.68 0 top
U9  45.16,67.23 270 top
U14  46.28,29.9 0 top
U$1  55.17,43.21 90 top
VIN  56.98,61.06 270 top
X1  9.14,0 0 top
Y1  44.53,55.69 180 top

### Tracks (layer width: path | path; a pad name or v marks a point on that pad's centre or on a via)
3V  (via drill 0.6)
  Top 0.254: C32.1 50.83,18.18 U5.17 48.19,18.14 46.2,18.14 45.57,18.77 45.57,25.12 45.8,25.35 46.68,25.35 47.5,26.16 48.26,26.16 49.1,27 49.1,27.13 | R38.2 49.1,27.13 | U14.8 44.36,31.61 v44.22,31.47 | v49.94,26.31 49.94,27.03 49.84,27.13 49.1,27.13
  Bottom 0.254: v44.22,31.47 44.22,28.27 44.6,27.89 49.35,27.89 49.94,27.3 v49.94,26.31
!RESET  (via drill 0.6)
  Top 0.203: U8.7 43.26,38.46 v43.48,38.23 | 57.1,42.88 JP9.1 57.83,43.61 R25.2
  Bottom 0.203: v43.48,38.23 43.99,38.23 44.83,39.06 54.38,39.04 54.81,39.47 54.81,42.67 55.32,43.18 JP9.1
+3V3  (via drill 0.5, 0.6)
  Top 0.203: U8.19 50.67,42.93 51,42.6 51.46,42.6 | U8.38 45.26,50.6 45.41,50.44 46.23,50.44 v47.37,49.3 47.37,47.3 48.24,46.43 U8.26 51.89,46.43 52.07,46.25 52.07,42.82 51.84,42.6 51.46,42.6 | U8.10 44.76,41.43 v44.2,41.99 | R6.1 30.53,41.29 R5.1 28.08,41.29 27.03,42.34 24.03,42.34 v23.37,43 | R1.1 28.19,65.5 R2.1 v24.94,65.58 22.94,63.58 22.94,58.67 23.64,57.97 R8.1 28.22,57.95 R4.1 | 52.3,67.72 51.86,67.28 R11.2 51.74,63.73 | R24.2 51.32,57.22 50.98,57.56 50.98,58.55 50.52,59 46.46,59 v46.23,59.23 | R22.1 24.79,35.28 v24.94,35.13 | JP9.2 52.35,40.64 51.49,41.5 51.49,42.57 51.46,42.6
  Top 0.254: R21.1 R22.1
  Top 0.406: U9.4 47.42,67.23 v46.23,66.04 | v45.95,68.25 47.6,68.25 47.65,68.3 47.65,67.97 47.9,67.72
  Top 1.016: C12.A 52.3,67.72 47.9,67.72 46.74,66.55 46.85,66.55 U9.4
  Bottom 0.203: v44.2,41.99 46.08,41.99 C3.1 | v24.94,65.58 25.58,65.58 | U1.1 20.93,40.95 20.93,42.34 21.59,43 v23.37,43 23.75,42.62 27.56,42.62 28.7,41.48 28.7,35.38 28.45,35.13 v24.94,35.13
  Bottom 0.254: 46.46,50.22 45.98,49.73 C8.1 45.79,49.73 46.18,49.35 46.18,42.55 46.25,42.47 46.25,42.07 C3.1
  Bottom 0.406: v47.37,49.3 46.46,50.22 46.15,50.52 46.15,58.57 46.23,58.65 v46.23,59.23 v46.23,66.04 | 18.49,55.22 18.49,61.9 18.9,62.31 U3.1 21.95,62.31 25.22,65.58 25.58,65.58 34.16,65.58 38.38,61.37 43.66,61.37 44.83,62.53 44.83,67.13 v45.95,68.25 | 18.49,55.22 18.49,50.07 | 18.49,50.07 C4.1 | 18.49,50.07 18.49,48.26 | 18.49,48.26 18.49,42.63 | 18.49,42.63 C6.1 | 18.49,42.63 18.49,41.38 19,40.87 20.85,40.87 U1.1 | U2.1 18.59,48.16 18.49,48.26 | U4.1 18.57,55.3 18.49,55.22
+9V  (via drill 0.6)
  Top 0.203: R43.2 40.87,61.11 40.06,61.92 40.06,64.65 U9.3
  Top 0.406: X1.9 9.56,66.64 9.65,66.55 | X1.11 9.14,65.64 | X1.13 9.02,64.64 | X1.15 9.28,63.64 9.65,64.01 | C7.A 32.41,67.97 32,67.56
  Top 0.61: v11.18,65.53 11.18,66.04 11.68,66.55
  Top 1.016: 11.68,66.55 11.68,66.04 v11.18,65.53 12.19,65.53 14.22,67.56 32,67.56 35.56,67.56 38.1,65.02 40.29,65.02 U9.3
  Bottom 0.406: X1.10 9.06,66.64 9.14,66.55 | X1.12 9.25,65.64 9.4,65.79 | X1.14 9.02,64.64 9.14,64.52 | X1.16 9.03,63.64 9.14,63.75
  Bottom 0.61: v11.18,63.75 v11.18,65.53
  other vias: 9.4,66.29 9.4,63.75 10.41,65.02
  pour Bottom: 8.89,66.8 11.68,66.8 11.68,63.25 8.89,63.25
  pour Top: 8.89,66.8 11.68,66.8 11.68,63.25 8.89,63.25
+12V  (via drill 0.6)  (1 unrouted)
  Top 0.203: R17.2 21.36,22.35 v22,22.99 | v17.37,40.21 17.37,42.44 18.75,43.81 18.75,63.75 v17.02,65.48
  Top 0.406: X1.1 9.65,70.64 | X1.3 9.14,69.64 | X1.5 9.65,68.64 | X1.7 8.96,67.64 9.14,67.82
  Bottom 0.203: v22,22.99 22,30.61 20.62,31.98 17.76,31.98 17.42,32.31 17.42,35.46 18.01,36.04 18.01,39.57 v17.37,40.21 | v17.02,65.48 17.02,68.35 15.34,70.03 11.56,70.03 11.33,69.8
  Bottom 0.406: X1.2 9.88,70.64 9.91,70.61 | X1.4 9.61,69.64 9.65,69.6 | X1.6 9.71,68.64 9.91,68.83
  other vias: 9.4,70.36 11.43,70.36 9.4,68.07 10.41,69.34
  pour Bottom: 9.14,67.82 11.18,67.82 11.68,68.33 11.68,71.12 9.14,71.12
  pour Top: 9.14,71.12 11.68,71.12 11.68,68.33 11.18,67.82 9.14,67.82
ECU-SS
  Top 0.254: Q2.3 12.06,22.55 LED3.C
  Top 0.406: X1.67 9.11,33.64 9.58,33.17 | X1.69 9.34,32.64 9.58,32.87 | X1.71 9.33,31.64 9.58,31.39
  Top 0.61: 9.58,33.17 9.58,32.87 9.58,31.39 9.58,28.09 10.03,27.64 Q2.3
ECU-SS-IN
  Top 0.406: X1.63 10.72,35.64 11.61,34.75 11.61,33.18 R9.2
GND  (via drill 0.5, 0.6)
  Top 0.203: U8.20 50.74,43.43 | 50.74,43.43 50.75,43.43 | 48.79,45.82 48.9,45.93 U8.25 50.56,45.93 51.05,45.44 v51.08,45.01 51.05,43.59 50.9,43.43 50.74,43.43 | 51.18,44.86 51.16,45.29 | U8.9 44.26,40.76 44.17,40.84 43.1,40.84 v42.32,41.63 | U8.41 43.76,52.2 43.16,52.81 | U8.57 37.27,45.43 37.26,45.44 39.06,45.44 39.12,45.39
  Top 0.406: X1.123 8.25,5.64 8.36,5.74 9.88,5.74 10.03,5.89 | X1.121 10.19,6.64 10.34,6.78 | X1.119 9.69,7.64 9.7,7.64 | X1.117 9.91,8.64
  Bottom 0.406: X1.124 8.25,5.64 8.36,5.74 9.7,5.74 | X1.122 9.83,6.64 | X1.120 9.69,7.64 9.7,7.64 | X1.118 9.68,8.64
  other vias: 11.46,2.16 58.14,74.37 23.22,49.81 11,49.86 10.9,37.52 29.92,33.88 15.72,73.3 22.48,65.3 23.14,57.12 50.24,52.76 46.51,19.68
  pour Top (rank 4): 9.27,0.03 59.94,0.03 59.94,76.19 9.27,76.19
  pour Bottom (rank 4): 9.14,0 59.94,0 59.94,76.2 9.14,76.2
N$2
  Top 0.254: Q2.1 16.94,26.68 R3.2 R7.1
N$3
  Top 0.203: R11.1 55.95,63.6 3V3.A
N$4  (via drill 0.6)
  Top 0.254: R38.1 49.1,33.55 v49.02,33.63 | v45.92,33.6 45.92,31.62 U14.7
  Bottom 0.254: v49.02,33.63 45.95,33.63 v45.92,33.6
N$7
  Top 0.203: R1.2 30.09,62.77 30.71,62.15 RX1.A
N$8
  Top 0.203: R2.2 28.11,60.59 29.49,59.21 31.87,59.21 TX1.A
N$12
  Top 0.203: R4.2 30.02,54.54 RX3.A
N$13
  Top 0.203: R8.2 28.19,52.32 28.96,51.56 TX3.A
N$17
  Top 0.203: R5.2 28.65,47.7 29.03,48.08 29.79,48.08 RX2.A
N$18
  Top 0.203: TX2.A 29.92,44.5 30.53,43.89 30.53,43.09 R6.2
N$20
  Top 0.254: R14.1 56.38,29.9 56.77,29.52 56.77,28.5 LED7.A
N$24
  Top 0.254: R21.2 20.62,33.63 20.37,33.88 20.37,34.47 19.46,35.38 18.87,35.38 18.64,35.61 18.64,39.7 19.1,40.16 20.39,40.16 RX4.A
N$26  (via drill 0.5)  (1 unrouted)
  Top 0.203: 39.53,45.93 v39.88,46.28
  Bottom 0.203: v39.88,46.28 39.88,47.24 40.16,47.52 41.24,47.52 C2.A
N$33
  Top 0.203: R43.1 VIN.A
N$34
  Top 0.203: U8.40 44.26,54.04 43.74,54.56 42.7,54.56 Y1.3 40.59,54.55 C11.1
N$36
  Top 0.203: U8.39 44.76,56.26 45.34,56.84 Y1.1 | Y1.1 | Y1.1 48.83,56.84 C10.1
N$38
  Top 0.203: R24.1 56.73,57.22 57,56.95 57,53.4 S1.2 55.72,52.12 53.26,52.12 52.65,51.51 52.65,45.74 53.06,45.34 R25.1
  Bottom 0.203: C9.1 55.11,51.51 S1.2
N$39
  Top 0.203: U8.15 47.26,40.78 47.5,41.02 48.26,41.02 48.46,40.82 48.46,36.58 49.48,35.56 JP9.4
N$40
  Top 0.203: U8.16 47.76,36.52 49.23,35.05 54.33,35.05 55.12,34.27 55.12,33.33 55.45,32.99 57.38,32.99 JP9.5
N$41  (via drill 0.5)
  Top 0.203: 48.64,41.55 48.64,43.76 48.82,43.94 49.74,43.94 U8.21
  Top 0.254: R14.2 52.09,29.9 51.56,30.43 51.56,31.67 v51.43,31.8 | v51,36.96 51,39.19 48.64,41.55
  Bottom 0.254: v51.43,31.8 51.43,36.52 v51,36.96
N$44
  Top 0.254: R22.2 21.06,35.28 20.62,35.71 20.62,37.66 TX4.A
N$49
  Top 0.254: LED3.A 16.7,22.3 R17.1
N$78
  Top 0.203: U5.16 49.24,17.53 49.68,17.09 49.68,15.49 49.94,15.24 52.58,15.24 53.82,13.99 53.82,11.76 53.62,11.56 51.56,11.56 CN1.D-
N$79
  Top 0.203: U5.15 48.23,15.9 47.7,15.37 47.7,12.68 48.03,12.34 50.22,12.34 CN1.D+
N$81
  Top 0.254: TX.A 56.84,24.41 57.51,23.75 57.51,22.61 57.2,22.3 57.27,22.3 R87.1
N$82
  Top 0.254: RX.A 55.21,22.53 R88.1
N$83
  Top 0.254: U5.23 49.23,22.08 49.48,22.33 49.48,24 49.91,24.43 51.1,24.43 TX.C
N$84
  Top 0.254: U5.22 50.67,21.43 51.05,21.82 51.05,22.49 RX.C
N$85  (via drill 0.6)
  Top 0.254: R87.2 55.32,20.64 R88.2 55.24,20.62 v53.11,20.62 52.98,20.5 52.86,20.37 52.86,19.38 52.6,19.13 49.71,19.13 49.63,19.2 49.63,19.86 49.36,20.13 U5.20 | U5.4 39.38,23.38 v39.34,23.34
  Top 0.61: CN1.VBUS 45.95,10.77 C33.A 43.01,11.12 C34.1
  Bottom 0.254: v39.34,23.34 44.7,23.34 46.02,22.02 52.43,22.02 52.81,21.64 52.81,20.93 v53.11,20.62
  Bottom 0.406: CN1.VBUS 48.08,10.77 47.45,11.4 47.45,16.33 48.11,16.99 51.69,16.99 52.58,17.88 52.58,20.09 v53.11,20.62
N$93
  Top 0.203: U5.1 40.92,26.21 41.35,26.64 45.64,26.64 45.95,26.95 U14.2 | U14.2
N$94
  Top 0.203: U5.5 42.14,22.73 42.42,23.01 42.42,25.73 42.82,26.14 46,26.14 46.63,26.77 46.63,28.17 U14.3
RS485-1-A  (via drill 0.6)
  Top 0.254: X1.21 9.4,60.64 v9.63,60.63
  Bottom 0.254: v9.63,60.63 9.6,62.08 9.98,62.46 14.12,62.46 U3.8
RS485-1-B  (via drill 0.5)
  Top 0.254: X1.23 8.82,59.64 v9.53,58.93
  Bottom 0.254: v9.53,58.93 9.65,58.93 10.87,60.15 10.87,60.73 11.18,61.04 U3.7
RS485-1-Y  (via drill 0.6)
  Top 0.254: X1.19 10.37,61.64 10.77,61.24 10.77,58.78 v11.05,58.5
  Bottom 0.254: v11.05,58.5 U3.5
RS485-1-Z  (via drill 0.6)
  Top 0.254: X1.17 10.72,62.64 11.73,61.62 11.73,59.89 v11.84,59.79
  Bottom 0.254: v11.84,59.79 14.5,59.79 U3.6
RS485-2-A  (via drill 0.6)
  Top 0.254: X1.29 6.43,56.36 v12.75,56.36
  Bottom 0.254: v12.75,56.36 14.3,56.36 14.63,56.03 14.63,55.32 U4.8
RS485-2-B  (via drill 0.6)
  Top 0.254: X1.31 10.58,55.64 v10.95,55.27
  Bottom 0.254: v10.95,55.27 11.76,55.27 12.98,54.05 14.58,54.05 U4.7
RS485-2-Y  (via drill 0.5)
  Top 0.254: X1.27 7.85,57.64 v7.98,57.51
  Bottom 0.254: v7.98,57.51 8.18,57.51 9.22,56.46 9.22,52.78 10.52,51.49 U4.5
RS485-2-Z  (via drill 0.5)
  Top 0.254: v9.7,57.53 9.32,57.53 8.31,58.7 6.1,58.7 5.99,58.6 5.5,58.6 X1.25
  Bottom 0.254: U4.6 10.62,52.76 9.93,53.44 9.96,57.33 v9.7,57.53
RS485-3-A  (via drill 0.6)
  Top 0.254: X1.37 13.1,52.64 13.97,51.77 13.97,49.58 v14.05,49.51
  Bottom 0.254: v14.05,49.51 14.05,48.72 U2.8
RS485-3-B  (via drill 0.6)
  Top 0.254: X1.39 11.3,51.64 12.27,50.67 12.27,47.17 v12.57,46.86
  Bottom 0.254: v12.57,46.86 14.58,46.86 U2.7
RS485-3-Y  (via drill 0.5)
  Top 0.254: X1.35 10.04,53.64 10.49,53.19 14.94,53.19 15.32,52.81 15.32,45.59 v16.59,44.32
  Bottom 0.254: v16.59,44.32 14.63,44.32 U2.5
RS485-3-Z  (via drill 0.5)
  Top 0.254: X1.33 9.96,54.64 10.57,54.03 16.38,54.03 17.3,53.11 17.3,45.9 v17.02,45.62
  Bottom 0.254: v17.02,45.62 U2.6
RS485-4-A  (via drill 0.6)
  Top 0.254: X1.47 9.91,43.64 11.48,42.06 11.48,41.22 v11.71,41
  Bottom 0.254: v11.71,41 14.63,41 U1.8
RS485-4-B  (via drill 0.6)
  Top 0.254: X1.49 9.76,42.64 10.64,41.76 10.64,39.88 v10.34,39.57
  Bottom 0.254: v10.34,39.57 14.68,39.57 U1.7
RS485-4-Y  (via drill 0.6)
  Top 0.254: X1.45 10.56,44.64 12.95,42.24 12.95,37.26 v12.65,36.96
  Bottom 0.254: v12.65,36.96 14.61,36.96 U1.5
RS485-4-Z  (via drill 0.6)
  Top 0.254: X1.43 11.03,45.64 14,42.67 14,39.09 U1.6 16.61,38.35 v16.71,38.38
  Bottom 0.254: v16.71,38.38 14.02,38.38 14,38.41 14.68,38.41 U1.6
RTD-HORN  (via drill 0.6)
  Top 0.203: v32.44,38.25 34.47,38.25 35.2,38.99 35.2,40.28 35.64,40.72 39.04,40.72 39.78,41.45 39.78,42.72 39.55,42.93 38.28,42.93 U8.62
  Bottom 0.203: R16.2 30.79,26.38 32.03,27.61 32.03,37.77 v32.44,38.25
RXD1  (via drill 0.6)
  Top 0.203: v37.59,38.23 40.39,38.23 40.77,38.61 40.77,39.92 U8.2 | RX1.C 34.87,62.16 v36,61.02
  Bottom 0.203: U3.2 20.73,61.09 22.48,61.09 23.37,61.98 JP3.2 35.05,61.98 v36,61.02 36.52,60.5 36.96,60.07 36.96,38.86 v37.59,38.23
RXD2  (via drill 0.6)
  Top 0.203: RX3.C 33.47,54.41 v33.98,53.9 | U8.11 45.26,36.47 v44.78,35.99
  Bottom 0.203: U4.2 20.8,53.98 22.86,53.98 23.65,54.76 JP4.2 33.12,54.76 v33.98,53.9 34.92,52.96 34.92,37.08 36.58,35.43 44.3,35.43 v44.78,35.99
RXD3  (via drill 0.5, 0.6)
  Top 0.203: v42.11,33.78 42.11,38.76 42.27,38.91 42.27,39.92 U8.5 | RX2.C 32.4,48.14 v33.4,47.14
  Bottom 0.203: U2.2 20.78,46.86 22.61,46.86 23.57,47.83 JP2.2 32.72,47.83 33.33,47.22 v33.4,47.14 33.88,46.66 33.88,35.76 35.43,34.21 41.78,34.21 v42.11,33.78
RXD4
  Top 0.203: U8.13 46.26,36.45 47.04,35.66 47.04,33.33 46.61,32.89 U14.6
  Top 0.254: RX4.C 25.17,39.98 JP1.2 27.76,40.51 28.91,39.37 28.91,37.69 29.49,37.11 34.11,37.11 35.26,35.97 35.26,30.89 35.87,30.28 46.35,30.28 46.61,30.53 U14.6
  Bottom 0.203: JP1.2 24.38,40.51 23.37,39.5 21.01,39.5 U1.2
SS  (via drill 0.6)
  Top 0.203: R7.2 23.11,28.55 v23.44,28.88 | v31.55,39.75 33.53,39.75 34.09,40.31 34.09,41.91 34.62,42.44 38.24,42.44 U8.63
  Bottom 0.203: v23.44,28.88 30.35,28.88 31.27,29.79 31.27,39.47 v31.55,39.75
SS-D
  Top 0.406: R9.1 R10.2
TXD1  (via drill 0.6)
  Top 0.203: v41.27,37.34 41.27,39.91 U8.3 | TX1.C 34.56,59.29 v35.81,58.04
  Bottom 0.203: U3.3 20.73,59.82 22.86,59.82 23.5,59.18 JP3.1 34.67,59.18 v35.81,58.04 35.94,57.91 35.94,38.48 37.34,37.08 41.02,37.08 v41.27,37.34
TXD2  (via drill 0.6)
  Top 0.203: U8.12 45.74,39.91 45.74,35.43 v46.13,35.08 | TX3.C 33.77,51.57 v33.91,51.44
  Bottom 0.203: U4.3 20.8,52.7 22.61,52.7 23.34,51.97 JP4.1 33.38,51.97 v33.91,51.44 34.42,50.93 34.42,36.58 36.2,34.8 45.87,34.82 v46.13,35.08
TXD3  (via drill 0.6)
  Top 0.203: v43.59,32.99 43.59,33.98 42.65,34.92 42.65,38.71 42.75,38.81 U8.6 | v32.51,43.26 32.51,44.53 TX2.C
  Bottom 0.203: U2.3 20.78,45.59 23.11,45.59 23.67,45.03 JP2.1 32,45.03 | 32,45.03 33.4,43.64 33.4,35.1 35.05,33.45 40.84,33.45 41.63,32.66 43.26,32.66 v43.59,32.99 | 32,45.03 32.03,45.03 33.17,43.89 33.17,43.84 33.38,43.64 32.89,43.64 v32.51,43.26
TXD4
  Top 0.203: U8.14 46.76,36.71 47.55,35.92 47.55,32.87 47.27,32.59 47.27,31.61 U14.5
  Top 0.254: TX4.C 25.68,37.69 JP1.1 28.12,37.72 29.29,36.55 33.81,36.55 34.65,35.71 34.65,30.5 35.28,29.87 35.31,29.87 35.43,29.74 46.79,29.74 47.27,30.23 47.27,31.57 U14.5
  Bottom 0.203: JP1.1 23.75,37.72 23.11,38.35 U1.3